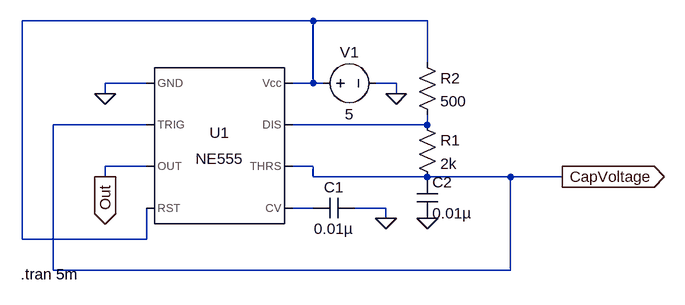
[diagram p0: schematic q2_1.asc]
q2_1.asc, the LTspice schematic file:
Version 4
SHEET 1 944 680
WIRE 368 -16 -80 -16
WIRE 544 -16 368 -16
WIRE 544 48 544 -16
WIRE 112 80 48 80
WIRE 368 80 368 -16
WIRE 368 80 336 80
WIRE 384 80 368 80
WIRE 496 80 464 80
WIRE 48 96 48 80
WIRE 496 96 496 80
WIRE 112 144 -32 144
WIRE 544 144 544 128
WIRE 544 144 336 144
WIRE 112 208 48 208
WIRE 368 208 336 208
WIRE 48 224 48 208
WIRE 368 224 368 208
WIRE 544 224 368 224
WIRE 672 224 544 224
WIRE 752 224 672 224
WIRE 368 272 336 272
WIRE 480 272 432 272
WIRE 480 288 480 272
WIRE 544 288 544 272
WIRE -80 320 -80 -16
WIRE 112 320 112 272
WIRE 112 320 -80 320
WIRE -32 368 -32 144
WIRE 672 368 672 224
WIRE 672 368 -32 368
FLAG 48 224 Out
IOPIN 48 224 Out
FLAG 48 96 0
FLAG 496 96 0
FLAG 480 288 0
FLAG 544 288 0
FLAG 752 224 CapVoltage
IOPIN 752 224 Out
SYMBOL Misc\\NE555 224 176 R0
SYMATTR InstName U1
SYMBOL voltage 368 80 R270
WINDOW 0 32 56 VTop 2
WINDOW 3 -32 56 VBottom 2
WINDOW 123 0 0 Left 0
WINDOW 39 0 0 Left 0
SYMATTR InstName V1
SYMATTR Value 5
SYMBOL cap 432 256 R90
WINDOW 0 0 32 VBottom 2
WINDOW 3 32 32 VTop 2
SYMATTR InstName C1
SYMATTR Value 0.01µ
SYMBOL res 528 32 R0
SYMATTR InstName R2
SYMATTR Value 500
SYMBOL res 528 128 R0
SYMATTR InstName R1
SYMATTR Value 2k
SYMBOL cap 528 224 R0
SYMATTR InstName C2
SYMATTR Value 0.01µ
TEXT -82 374 Left 2 !.tran 5m

The netlist it stands for:
* q2_1.asc
XU1 0 CapVoltage Out N001 N003 CapVoltage N002 N001 NE555  ; pins GND TRIG OUT RST CV THRS DIS Vcc
V1 N001 0 5
C1 0 N003 0.01µ
R2 N001 N002 500
R1 N002 CapVoltage 2k
C2 CapVoltage 0 0.01µ
.tran 5m
.lib NE555.sub
.backanno
.end